# EAGLE design Gesamtschaltung (EAGLE 6.5.0)
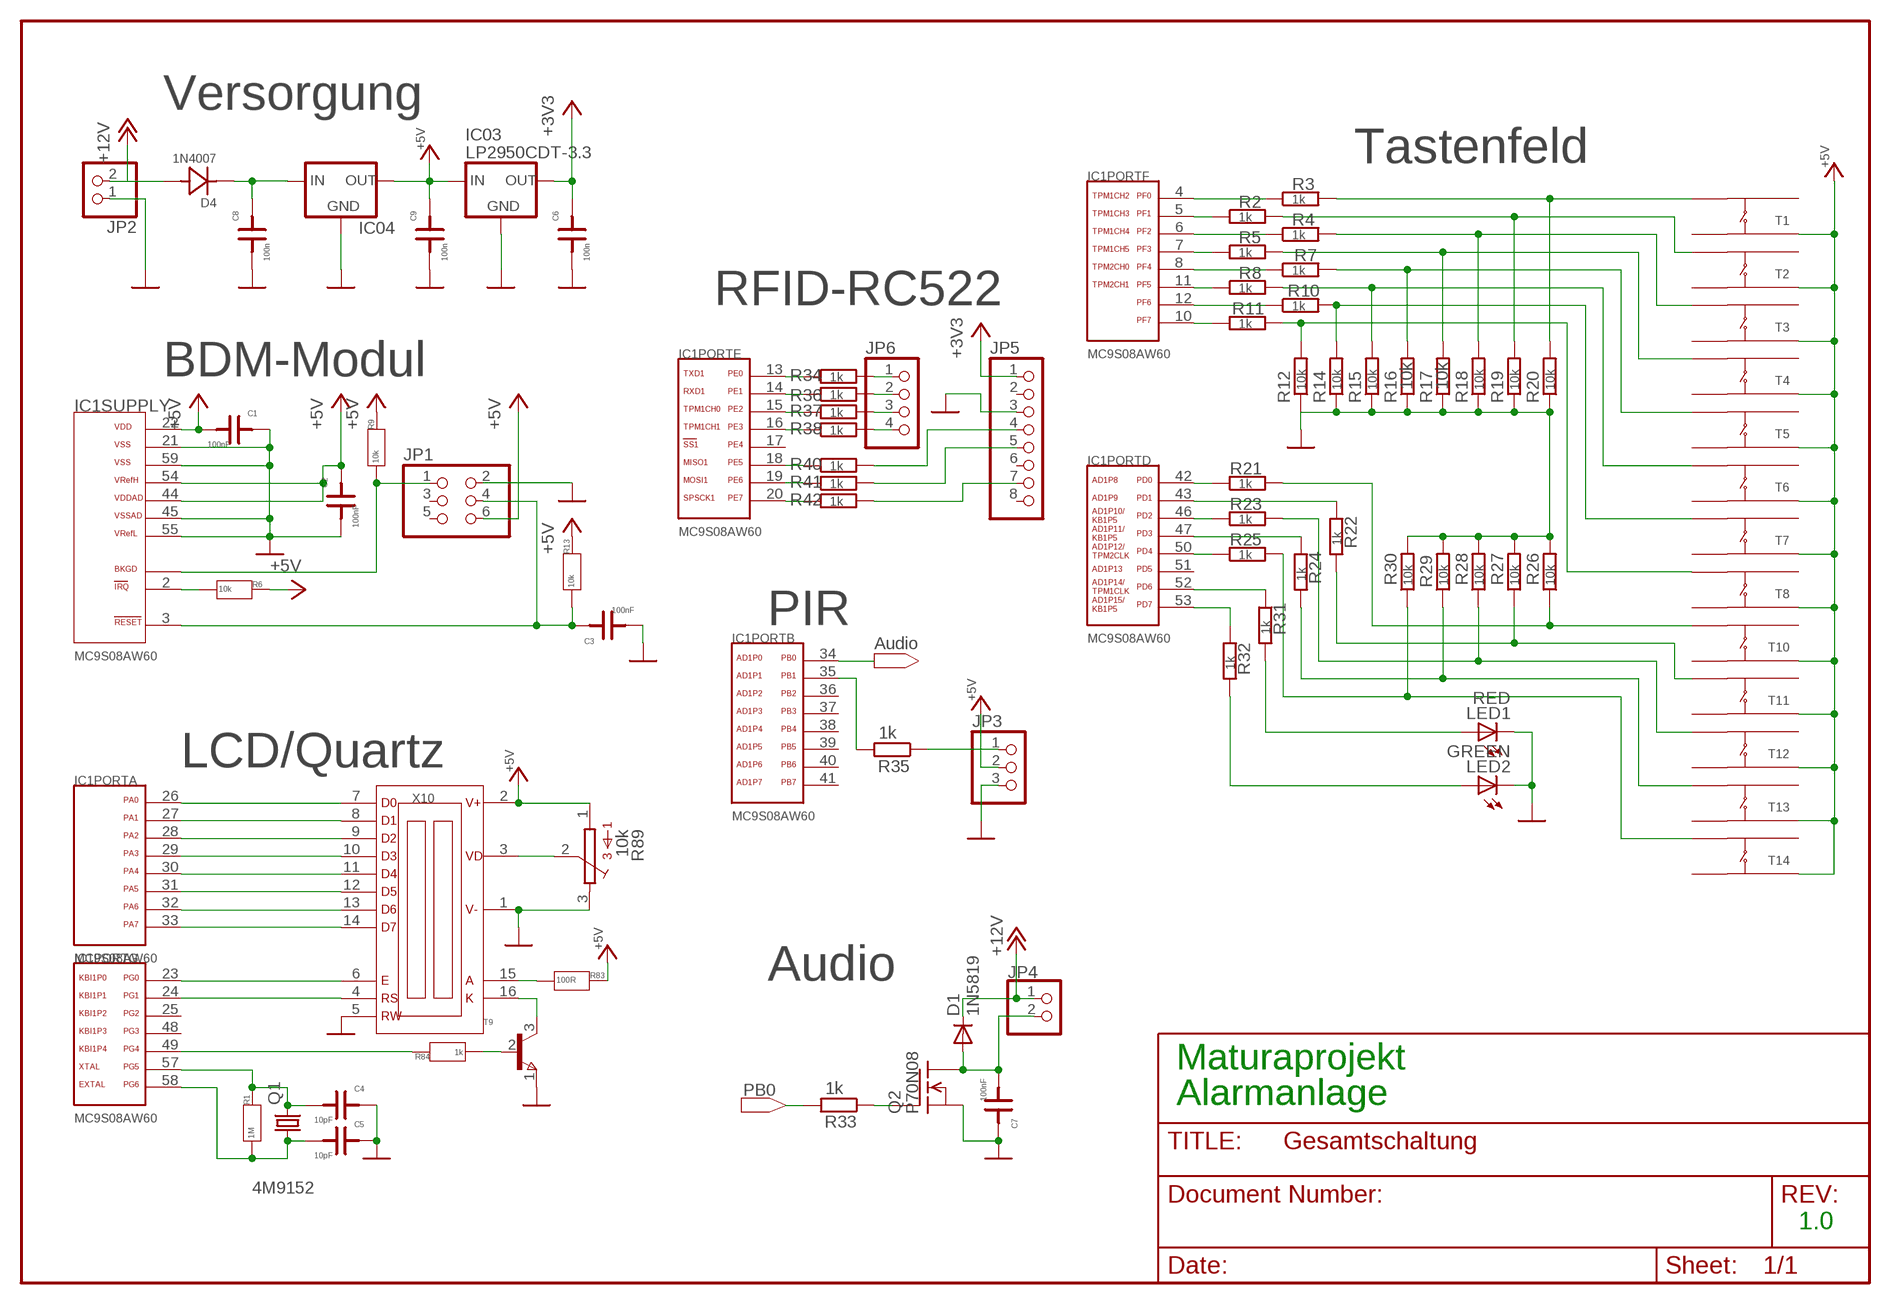
[diagram p0: schematic, sheet 1]

## Parts
C1  100nF  C1  [0805F]
C2  100nF  C1  [0805F]
C3  100nF  C1  [0805F]
C4  10pF  C1  [0805F]
C5  10pF  C1  [0805F]
C6  100n  C1  [0805F]
C7  100nF  C1  [0805F]
C8  100n  C1  [0805F]
C9  100n  C1  [0805F]
D1  1N5819  1N4004  [DO41-10]
D4  1N4007  DHC  [D400BH]
IC1  MC9S08AW60  [LQFP64]
IC03  LP2950CDT-3.3  [DPACK]
IC04  78XXS  [78XXS]
JP1  PINHD-2X3  [2X03]
JP2  PINHD-1X2  [1X02]
JP3  PINHD-1X3  [1X03]
JP4  PINHD-1X2  [1X02]
JP5  PINHD-1X8  [1X08]
JP6  PINHD-1X4  [1X04]
LED1  RED  LED3MM  [LED3MM]
LED2  GREEN  LED3MM  [LED3MM]
Q1  4M9152  HC49UP  [HC49UP]
Q2  P70N08  BUZ11  [TO220]
R1  1M  R1  [0805]
R2  1k  R-EU_M0805  [M0805]
R3  1k  R-EU_M0805  [M0805]
R4  1k  R-EU_M0805  [M0805]
R5  1k  R-EU_M0805  [M0805]
R6  10k  R1  [0805]
R7  1k  R-EU_M0805  [M0805]
R8  1k  R-EU_M0805  [M0805]
R9  10k  R1  [0805]
R10  1k  R-EU_M0805  [M0805]
R11  1k  R-EU_M0805  [M0805]
R12  10k  R-EU_M0805  [M0805]
R13  10k  R1  [0805]
R14  10k  R-EU_M0805  [M0805]
R15  10k  R-EU_M0805  [M0805]
R16  10k  R-EU_M0805  [M0805]
R17  10k  R-EU_M0805  [M0805]
R18  10k  R-EU_M0805  [M0805]
R19  10k  R-EU_M0805  [M0805]
R20  10k  R-EU_M0805  [M0805]
R21  1k  R-EU_M0805  [M0805]
R22  1k  R-EU_M0805  [M0805]
R23  1k  R-EU_M0805  [M0805]
R24  1k  R-EU_M0805  [M0805]
R25  1k  R-EU_M0805  [M0805]
R26  10k  R-EU_M0805  [M0805]
R27  10k  R-EU_M0805  [M0805]
R28  10k  R-EU_M0805  [M0805]
R29  10k  R-EU_M0805  [M0805]
R30  10k  R-EU_M0805  [M0805]
R31  1k  R-EU_R0805  [R0805]
R32  1k  R-EU_R0805  [R0805]
R33  1k  R-EU_0207/10  [0207/10]
R34  1k  R-EU_M0805  [M0805]
R35  1k  R-EU_M0805  [M0805]
R36  1k  R-EU_M0805  [M0805]
R37  1k  R-EU_M0805  [M0805]
R38  1k  R-EU_M0805  [M0805]
R40  1k  R-EU_M0805  [M0805]
R41  1k  R-EU_M0805  [M0805]
R42  1k  R-EU_M0805  [M0805]
R83  100R  R1  [0805]
R84  1k  R1  [0805]
R89  10k  S63X  [S63X]
T1  TASTERTHT  [TASTE_THT]
T2  TASTERTHT  [TASTE_THT]
T3  TASTERTHT  [TASTE_THT]
T4  TASTERTHT  [TASTE_THT]
T5  TASTERTHT  [TASTE_THT]
T6  TASTERTHT  [TASTE_THT]
T7  TASTERTHT  [TASTE_THT]
T8  TASTERTHT  [TASTE_THT]
T9  BC817  [SOT-23]
T10  TASTERTHT  [TASTE_THT]
T11  TASTERTHT  [TASTE_THT]
T12  TASTERTHT  [TASTE_THT]
T13  TASTERTHT  [TASTE_THT]
T14  TASTERTHT  [TASTE_THT]
X10  FDCC1602E  [FDCC1602E]

## Nets
+3V3: C6.2 IC03.3(OUT) JP5.1
+5V: C1.1 C2.2 C9.2 IC1.22(SUPPLY:VDD) IC1.44(SUPPLY:VDDAD) IC1.54(SUPPLY:VREFH) IC03.1(IN) IC04.OUT JP1.6 JP3.2 R6.2 R9.2 R13.2 R83.2 R89.1 T1.A1 T2.A1 T3.A1 T4.A1 T5.A1 T6.A1 T7.A1 T8.A1 T10.A1 T11.A1 T12.A1 T13.A1 T14.A1 X10.2(V+)
+12V: D1.C D4.A JP2.2 JP4.1
BKGD: IC1.56(SUPPLY:BKGD) JP1.1 R9.1
D0: IC1.26(PORTA:PA0) X10.7(D0)
D1: IC1.27(PORTA:PA1) X10.8(D1)
D2: IC1.28(PORTA:PA2) X10.9(D2)
D3: IC1.29(PORTA:PA3) X10.10(D3)
GND: C1.2 C2.1 C3.1 C4.2 C5.2 C6.1 C7.2 C8.1 C9.1 IC1.21(SUPPLY:VSS) IC1.45(SUPPLY:VSSAD) IC1.55(SUPPLY:VREFL) IC1.59(SUPPLY:VSS2) IC03.4(GND) IC04.GND JP1.2 JP2.1 JP3.3 JP5.3 LED1.K(C) LED2.K(C) Q2.3(S) R12.1 R14.1 R15.1 R16.1 R17.1 R18.1 R19.1 R20.1 R26.2 R27.2 R28.2 R29.2 R30.2 R89.3 T9.1(E) X10.1(V-) X10.5(RW)
IRQ: IC1.2(SUPPLY:IRQ/) R6.1
LCD_LED: IC1.49(PORTG:PG4) R84.2
N$1: C8.2 D4.K IC04.IN
N$2: R3.2 R20.2 T1.B2
N$3: R2.2 R19.2 T2.B2
N$4: IC1.42(PORTD:PD0) R21.1
N$5: R4.2 R18.2 T3.B2
N$6: R5.2 R17.2 T4.B2
N$7: R7.2 R16.2 T5.B2
N$8: IC1.46(PORTD:PD2) R23.1
N$9: IC1.50(PORTD:PD4) R25.1
N$10: R21.2 R26.1 T10.B2
N$11: R8.2 R15.2 T6.B2
N$12: R10.2 R14.2 T7.B2
N$13: R11.2 R12.2 T8.B2
N$14: IC1.5(PORTF:PF1) R2.1
N$15: IC1.6(PORTF:PF2) R4.1
N$16: C4.1 IC1.57(PORTG:PG5) Q1.2 R1.2
N$17: IC1.43(PORTD:PD1) R22.1
N$18: IC1.47(PORTD:PD3) R24.1
N$19: R22.2 R27.1 T11.B2
N$20: IC1.53(PORTD:PD7) R32.1
N$21: IC1.7(PORTF:PF3) R5.1
N$22: C5.1 IC1.58(PORTG:PG6) Q1.1 R1.1
N$23: IC1.8(PORTF:PF4) R7.1
N$24: IC1.11(PORTF:PF5) R8.1
N$25: IC1.12(PORTF:PF6) R10.1
N$26: IC1.10(PORTF:PF7) R11.1
N$27: IC1.4(PORTF:PF0) R3.1
N$28: R24.2 R29.1 T13.B2
N$29: IC1.52(PORTD:PD6) R31.1
N$30: R23.2 R28.1 T12.B2
N$31: R25.2 R30.1 T14.B2
N$32: IC1.13(PORTE:PE0) R34.1
N$33: LED2.A R32.2
N$34: LED1.A R31.2
N$35: JP5.7 R42.2
N$36: IC1.34(PORTB:PB0) R33.2
N$37: JP3.1 R35.1
N$38: JP5.5 R41.2
N$39: JP5.4 R40.2
N$40: Q2.1(G) R33.1
N$41: IC1.35(PORTB:PB1) R35.2
N$42: IC1.14(PORTE:PE1) R36.1
N$43: IC1.15(PORTE:PE2) R37.1
N$44: IC1.16(PORTE:PE3) R38.1
N$45: JP6.4 R38.2
N$46: C7.1 D1.A JP4.2 Q2.2(D)
N$47: IC1.18(PORTE:PE5) R40.1
N$48: IC1.19(PORTE:PE6) R41.1
N$49: IC1.30(PORTA:PA4) X10.11(D4)
N$50: IC1.31(PORTA:PA5) X10.12(D5)
N$51: IC1.32(PORTA:PA6) X10.13(D6)
N$52: IC1.33(PORTA:PA7) X10.14(D7)
N$53: IC1.20(PORTE:PE7) R42.1
N$54: JP6.3 R37.2
N$55: IC1.23(PORTG:PG0) X10.6(E)
N$56: JP6.2 R36.2
N$57: JP6.1 R34.2
N$58: IC1.24(PORTG:PG1) X10.4(RS)
N$60: R89.2 X10.3(VD)
N$86: R83.1 X10.15(A)
N$87: T9.3(C) X10.16(K)
N$88: R84.1 T9.2(B)
RESET: C3.2 IC1.3(SUPPLY:RST/) JP1.4 R13.1
Unconnected: IC1.1(PORTC:PC4) IC1.9(PORTC:PC6) IC1.17(PORTE:PE4) IC1.25(PORTG:PG2) IC1.36(PORTB:PB2) IC1.37(PORTB:PB3) IC1.38(PORTB:PB4) IC1.39(PORTB:PB5) IC1.40(PORTB:PB6) IC1.41(PORTB:PB7) IC1.48(PORTG:PG3) IC1.51(PORTD:PD5) IC1.60(PORTC:PC0) IC1.61(PORTC:PC1) IC1.62(PORTC:PC2) IC1.63(PORTC:PC3) IC1.64(PORTC:PC5) JP1.3 JP1.5 JP5.2 JP5.6 JP5.8 T1.A2 T1.B1 T2.A2 T2.B1 T3.A2 T3.B1 T4.A2 T4.B1 T5.A2 T5.B1 T6.A2 T6.B1 T7.A2 T7.B1 T8.A2 T8.B1 T10.A2 T10.B1 T11.A2 T11.B1 T12.A2 T12.B1 T13.A2 T13.B1 T14.A2 T14.B1

## Notes on the sheet
- Versorgung
- Tastenfeld
- RFID-RC522
- BDM-Modul
- PIR
- Audio
- LCD/Quartz
- Audio
- Maturaprojekt
- PB0
- Alarmanlage
- 1.0

## Library data of the parts
C1-C9 = deto:C
D1 = diode:1N4004: DIODE general purpose rectifier, 1 A
D4 = deto:DHC: Hii-Curr-Diode, Silizium, Typ Gleichrichter z.B. wie 1N4007 oder ähnlich
IC1 = MOTOROLA:MC9S08AW60
IC03 = v-reg:LP2950?*: Source: http://cache.national.com/ds/LP/LP2950.pdf
IC04 = v-reg:78XXS: VOLTAGE REGULATOR
JP1 = pinhead:PINHD-2X3
JP2 JP4 = pinhead:PINHD-1X2: PIN HEADER
JP3 = pinhead:PINHD-1X3: PIN HEADER
JP5 = pinhead:PINHD-1X8: PIN HEADER
JP6 = pinhead:PINHD-1X4: PIN HEADER
LED1 LED2 = led:LED: LED OSRAM: - CHIPLED LG R971, LG N971, LY N971, LG Q971, LY Q971, LO R971, LY R971 LH N974, LH R974 LS Q976, LO Q976, LY Q976 LO Q996 - Hyper CHIPLED LW Q18S LB Q993, LB Q99A, LB R99A - SideLED LS A670, LO A670, LY A670, LG A670, LP A670 LB A673, LV A673, LT A673, LW A673 LH A674 LY A675 LS A676, LA A676, LO A676, LY A676, LW A676 LS A679, LY A679, LG A679 - Hyper Micro SIDELED® LS Y876, LA Y876, LO Y876, LY Y876 LT Y87S - SmartLED LW L88C, LW L88S LB L89C, LB L89S, LG L890 LS L89K, LO L89K, LY L89K LS L896, LA L896, LO L896, LY L896 - TOPLED LS T670, LO T670, LY T670, LG T670, LP T670 LSG T670, LSP T670, LSY T670, LOP T670, LYG T670 LG T671, LOG T671, LSG T671 LB T673, LV T673, LT T673, LW T673 LH T674 LS T676, LA T676, LO T676, LY T676, LB T676, LH T676, LSB T676, LW T676 LB T67C, LV T67C, LT T67C, LS T67K, LO T67K, LY T67K, LW E67C LS E67B, LA E67B, LO E67B, LY E67B, LB E67C, LV E67C, LT E67C LW T67C LS T679, LY T679, LG T679 LS T770, LO T770, LY T770, LG T770, LP T770 LB T773, LV T773, LT T773, LW T773 LH T774 LS E675, LA E675, LY E675, LS T675 LS T776, LA T776, LO T776, LY T776, LB T776 LHGB T686 LT T68C, LB T68C - Hyper Mini TOPLED® LB M676 - Mini TOPLED Santana® LG M470 LS M47K, LO M47K, LY M47K Source: http://www.osram.convergy.de LUXEON: - LUMILED® LXK2-PW12-R00, LXK2-PW12-S00, LXK2-PW14-U00, LXK2-PW14-V00 LXK2-PM12-R00, LXK2-PM12-S00, LXK2-PM14-U00 LXK2-PE12-Q00, LXK2-PE12-R00, LXK2-PE12-S00, LXK2-PE14-T00, LXK2-PE14-U00 LXK2-PB12-K00, LXK2-PB12-L00, LXK2-PB12-M00, LXK2-PB14-N00, LXK2-PB14-P00, LXK2-PB14-Q00 LXK2-PR12-L00, LXK2-PR12-M00, LXK2-PR14-Q00, LXK2-PR14-R00 LXK2-PD12-Q00, LXK2-PD12-R00, LXK2-PD12-S00 LXK2-PH12-R00, LXK2-PH12-S00 LXK2-PL12-P00, LXK2-PL12-Q00, LXK2-PL12-R00 Source: www.luxeon.com KINGBRIGHT: KA-3528ASYC Source: www.kingbright.com
Q1 = crystal:HC49UP: CRYSTAL
Q2 = transistor-fet:BUZ11: N-Channel Enhancement MOSFET 50V; 30A; 0,040Ohm
R1 R6 R9 R13 R83 R84 = deto:R: Widerstand 400 mil - 0805 - 1206
R2-R5 R7 R8 R10-R12 R14-R38 R40-R42 = rcl:R-EU_: RESISTOR, European symbol
R89 = pot:S63X: POTENTIOMETER
T1-T8 T10-T14 = deto:TASTER: Taste SMD, Typ DIPTRONICS DTSM-644K Distrelec-Best.Nr: 200312
T9 = deto:BC817
X10 = DISP-LCD:FDCC1602: LCD 2x16 Zeichen FDCC1602_x_FLYYBWJ Fordatata, wobei das "x" durch das Variant ersetzt wird! www.fordata.com

## Board
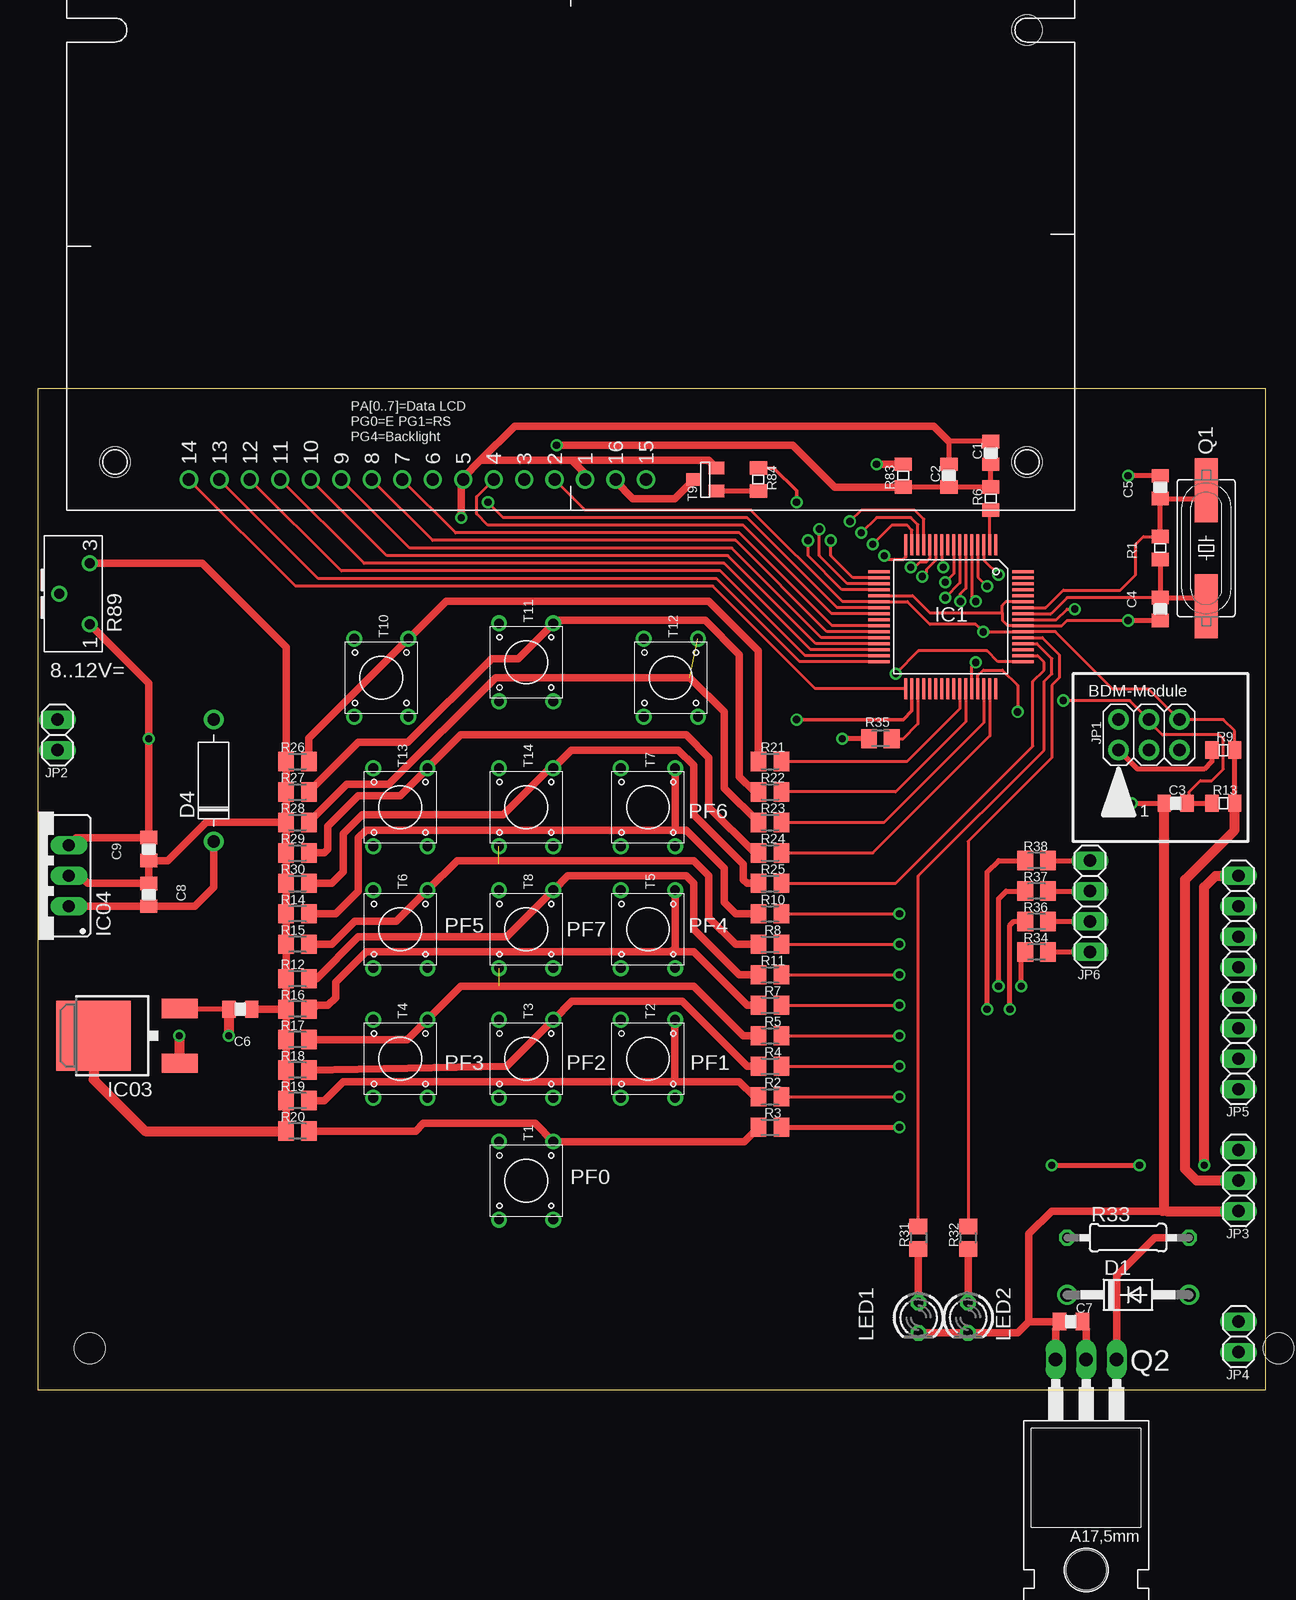
[diagram p1: board, top side]
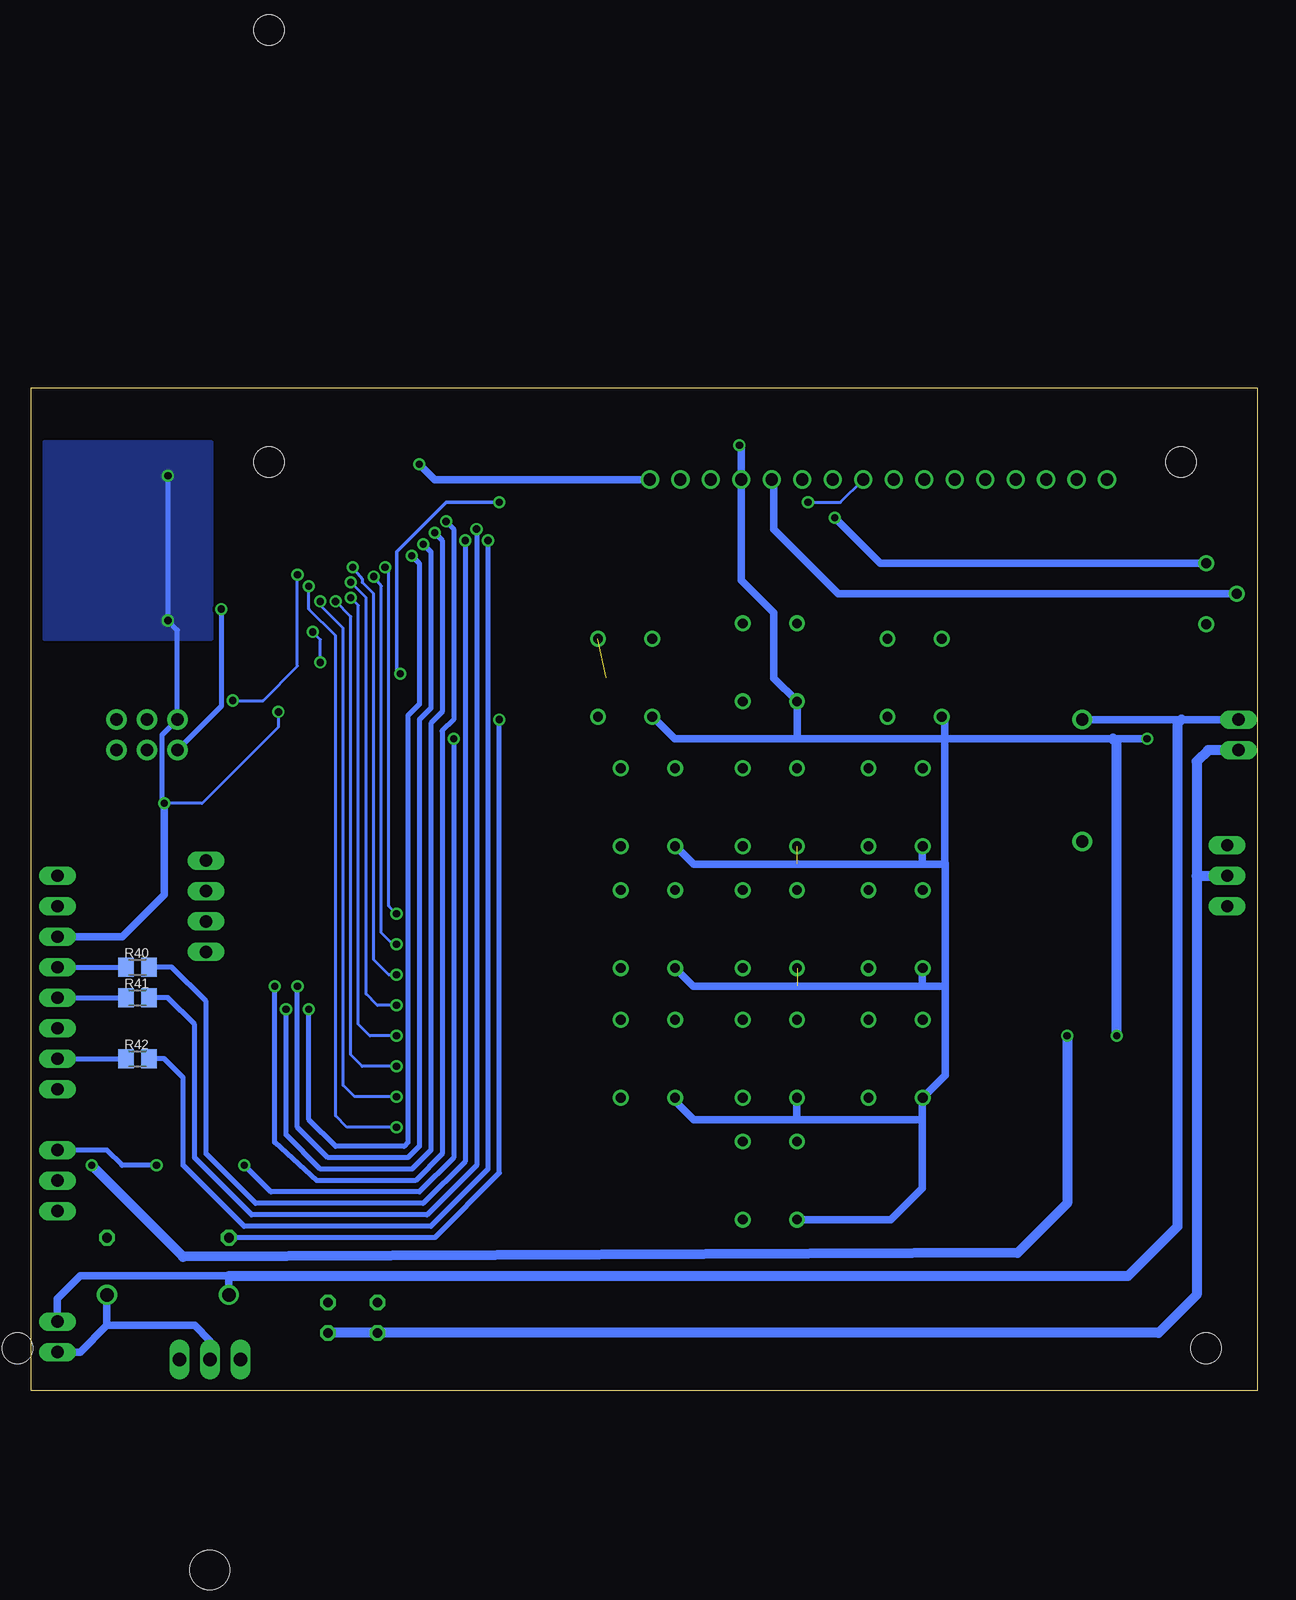
[diagram p2: board, bottom side, seen from below]

No outline drawn. Coordinates in mm, seen from the top.
Copper layers (1*16): Top 0.035mm / dielectric 1.5mm / Bottom 0.035mm
Design rules "default *": minimum track width 0.253746875mm, minimum drill 19mil, track to track 8mil, track to pad 8mil, pad to pad 8mil, via to via 8mil, smd to smd 8mil, copper to edge 40mil, drill to drill 8mil, minimum pad ring 10mil, minimum via ring 8mil, stop-mask expansion 0mil, vias tented up to drill 0mil, thermal gap 10mil
Holes 2.54 mm at 4.92,146.05 103.98,146.05 103.98,3.81 4.92,3.81
Milling: 5 lines

### Footprints (pad centres in the part's own frame; a part is rotated, then mirrored left to right if it is on the bottom)
0805F = smd 1.118 x 1.422: 1 -0.953,0; 2 0.953,0
DO41-10 = drill 1.118: A 5.08,0; C -5.08,0
D400BH = drill 1.016 pad 1.651: A 3.81,-1.27; K -6.35,-1.27
LQFP64 = smd 1.778 x 0.254: 1 -6,3.75; 2 -6,3.25; 3 -6,2.75; 4 -6,2.25; 5 -6,1.75; 6 -6,1.25; 7 -6,0.75; 8 -6,0.25; 9 -6,-0.25; 10 -6,-0.75; 11 -6,-1.25; 12 -6,-1.75; 13 -6,-2.25; 14 -6,-2.75; 15 -6,-3.25; 16 -6,-3.75; 33 6,-3.75; 34 6,-3.25; 35 6,-2.75; 36 6,-2.25; 37 6,-1.75; 38 6,-1.25; 39 6,-0.75; 40 6,-0.25; 41 6,0.25; 42 6,0.75; 43 6,1.25; 44 6,1.75; 45 6,2.25; 46 6,2.75; 47 6,3.25; 48 6,3.75 | smd 0.254 x 1.778: 17 -3.75,-6; 18 -3.25,-6; 19 -2.75,-6; 20 -2.25,-6; 21 -1.75,-6; 22 -1.25,-6; 23 -0.75,-6; 24 -0.25,-6; 25 0.25,-6; 26 0.75,-6; 27 1.25,-6; 28 1.75,-6; 29 2.25,-6; 30 2.75,-6; 31 3.25,-6; 32 3.75,-6; 49 3.75,6; 50 3.25,6; 51 2.75,6; 52 2.25,6; 53 1.75,6; 54 1.25,6; 55 0.75,6; 56 0.25,6; 57 -0.25,6; 58 -0.75,6; 59 -1.25,6; 60 -1.75,6; 61 -2.25,6; 62 -2.75,6; 63 -3.25,6; 64 -3.75,6
DPACK = smd 1.6 x 3: 1 -2.28,-4.8; 3 2.28,-4.8 | smd 5.8 x 6.2: 4 0,2.38
78XXS = drill 1.016 long: GND 0,-2.54; IN -2.54,-2.54; OUT 2.54,-2.54
2X03 = drill 1.016 pad 1.676: 1 -2.54,-1.27; 2 -2.54,1.27; 3 0,-1.27; 4 0,1.27; 5 2.54,-1.27; 6 2.54,1.27
1X02 = drill 1.016 long: 1 -1.27,0; 2 1.27,0
1X03 = drill 1.016 long: 1 -2.54,0; 2 0,0; 3 2.54,0
1X08 = drill 1.016 long: 1 -8.89,0; 2 -6.35,0; 3 -3.81,0; 4 -1.27,0; 5 1.27,0; 6 3.81,0; 7 6.35,0; 8 8.89,0
1X04 = drill 1.016 long: 1 -3.81,0; 2 -1.27,0; 3 1.27,0; 4 3.81,0
LED3MM = drill 0.813 octagon: A -1.27,0; K 1.27,0
HC49UP = smd 5.334 x 1.93: 1 -4.826,0; 2 4.826,0
TO220 = drill 1.118 long: 1 -2.54,-6.35; 2 0,-6.35; 3 2.54,-6.35 | hole 3.302: 0,11.176
0805 = smd 1.118 x 1.422: 1 -0.953,0; 2 0.953,0
M0805 = smd 1.3 x 1.6: 1 -0.95,0; 2 0.95,0
R0805 = smd 1.3 x 1.5: 1 -0.95,0; 2 0.95,0
0207/10 = drill 0.813 octagon: 1 -5.08,0; 2 5.08,0
S63X = drill 0.813: 1 2.54,0; 2 0,-2.54; 3 -2.54,0
TASTE_THT = drill 0.813: A1 -3.251,2.261; A2 3.251,2.261; B1 -3.251,-2.261; B2 3.251,-2.261
SOT-23 = smd 1.016 x 1.27: 1 -0.953,0.953; 2 0.953,0.953; 3 0,-0.953
FDCC1602E = drill 1.016: 1 43.18,2.54; 2 40.64,2.54; 3 38.1,2.54; 4 35.56,2.54; 5 33.02,2.54; 6 30.48,2.54; 7 27.94,2.54; 8 25.4,2.54; 9 22.86,2.54; 10 20.32,2.54; 11 17.78,2.54; 12 15.24,2.54; 13 12.7,2.54; 14 10.16,2.54; 15 48.26,2.54; 16 45.72,2.54 | hole 2.54: 4,4; 80,4; 80,40

### Placement (x,y rotation side)
C1  80.01,78.42 90 top
C2  76.52,76.52 270 top
C3  95.41,49.21 0 top
C4  94.14,65.41 270 top
C5  94.14,75.57 90 top
C6  17.46,32.07 180 top
C7  86.68,6.03 180 top
C8  9.84,41.59 270 top
C9  9.84,45.4 90 top
D1  91.44,8.26 0 top
D4  13.97,52.39 90 top
IC1  76.68,64.77 270 top
IC03  7.62,29.84 90 top
IC04  0.64,43.18 90 top
JP1  93.19,54.93 0 top
JP2  2.22,54.93 90 top
JP3  100.65,17.78 270 top
JP4  100.65,4.76 270 top
JP5  100.65,34.29 270 top
JP6  88.27,40.64 90 top
LED1  73.98,6.35 270 top
LED2  78.11,6.35 270 top
Q1  97.95,70.49 270 top
Q2  87.95,-3.49 180 top
R1  94.14,70.49 270 top
R2  61.59,24.77 180 top
R3  61.59,22.23 180 top
R4  61.59,27.3 180 top
R5  61.59,29.84 180 top
R6  80.01,74.61 90 top
R7  61.59,32.38 180 top
R8  61.59,37.47 180 top
R9  99.38,53.66 0 top
R10  61.59,40.01 180 top
R11  61.59,34.92 180 top
R12  22.23,34.61 0 top
R13  99.38,49.21 0 top
R14  22.23,40.01 0 top
R15  22.23,37.47 0 top
R16  22.23,32.07 0 top
R17  22.23,29.53 0 top
R18  22.23,26.99 0 top
R19  22.23,24.45 0 top
R20  22.23,21.91 0 top
R21  61.59,52.7 180 top
R22  61.59,50.16 180 top
R23  61.59,47.62 180 top
R24  61.59,45.09 180 top
R25  61.59,42.55 180 top
R26  22.23,52.7 180 top
R27  22.23,50.16 180 top
R28  22.23,47.62 180 top
R29  22.23,45.09 180 top
R30  22.23,42.55 180 top
R31  73.98,13.02 270 top
R32  78.11,13.02 270 top
R33  91.44,13.02 180 top
R34  83.82,36.83 0 top
R35  70.8,54.61 0 top
R36  83.82,39.37 0 top
R37  83.82,41.91 0 top
R38  83.82,44.45 0 top
R40  93.98,35.56 180 bottom
R41  93.98,33.02 180 bottom
R42  93.98,27.94 180 bottom
R83  72.71,76.52 270 top
R84  60.64,76.2 90 top
R89  4.92,66.67 270 top
T1  41.27,17.78 90 top
T2  51.44,27.94 90 top
T3  41.27,27.94 90 top
T4  30.8,27.94 90 top
T5  51.44,38.73 90 top
T6  30.8,38.73 90 top
T7  51.44,48.9 90 top
T8  41.27,38.73 90 top
T9  56.2,76.2 270 top
T10  29.21,59.69 90 top
T11  41.27,60.96 90 top
T12  53.34,59.69 90 top
T13  30.8,48.9 90 top
T14  41.27,48.9 90 top
X10  3.02,73.66 0 top

### Tracks (layer width: path | path; a pad name or v marks a point on that pad's centre or on a via)
+3V3  (via drill 0.6)
  Top 0.406: C6.2 12.48,32.07 IC03.3
  Top 0.813: C6.2 v16.51,29.84 | v97.79,19.05 97.79,42.23 98.74,43.18 JP5.1
  Bottom 0.813: v16.51,29.84 16.51,15.88 20.64,11.75 90.17,11.43 v97.79,19.05
+5V  (via drill 0.6)  (2 unrouted)
  Top 0.254: R9.2 100.33,55.24 99.38,56.2 JP1.6 93.19,58.74 90.17,58.74 85.39,63.52 IC1.54 82.66,63.5 v79.38,63.5 78.74,64.14 74.93,64.14 73.05,66.02 IC1.22 67.65,66.02 60.01,73.66 46.2,73.66 X10.2 | IC1.44 78.43,60.64 78.42,60.64 v78.74,60.96
  Top 0.406: R13.2 R9.2 | C1.1 R6.2 C2.2 R83.2
  Top 0.61: IC04.OUT 3.81,46.35 C9.2 v9.84,54.61 9.84,59.21 R89.1 | v43.81,79.06 63.5,79.06 66.99,75.56 R83.2
  Top 0.813: IC03.1 12.42,29.81 v12.38,29.84 | JP3.2 97.16,17.78 96.2,18.73 96.2,42.86 100.33,46.99 R13.2
  Bottom 0.254: v78.74,60.96 78.74,62.87 v79.38,63.5
  Bottom 0.61: v9.84,54.61 12.7,54.61 26.71,54.61 | 26.71,54.61 26.71,56.24 26.99,56.52 T10.A1 26.67,56.2 | T13.A1 28.57,45.4 28.57,44.13 | 26.67,44.13 26.71,44.49 26.71,54.61 | 28.57,44.13 26.67,44.13 | 26.67,44.13 26.67,33.97 | 28.57,33.97 39.05,33.97 | 39.05,33.97 47.66,33.97 T5.A1 | T7.A1 49.14,45.64 47.62,44.13 39.05,44.13 | 39.05,44.13 28.57,44.13 | 26.67,33.97 28.57,33.97 | 28.57,33.97 28.57,35.45 T6.A1 | 39.01,34.01 39.05,33.97 | 39.01,44.17 39.05,44.13 | T12.A1 51.04,56.44 49.21,54.61 39.05,54.61 | 39.05,54.61 26.71,54.61 | 39.05,54.61 39.01,55.21 T11.A1 40.96,59.65 40.96,65.09 43.66,67.79 X10.2 43.66,78.9 v43.81,79.06 | 26.67,33.97 26.67,26.56 T4.A1 28.57,24.65 28.57,22.86 | T1.A1 31.19,14.53 28.57,17.14 28.57,22.86 | T2.A1 49.17,24.41 47.62,22.86 39.05,22.86 | 39.05,22.86 28.57,22.86 | T3.A1 39.01,24.73 39.05,24.77 39.05,22.86
  Bottom 0.813: v12.38,29.84 12.38,54.29 12.7,54.61
+12V
  Bottom 0.61: JP2.2 6.99,56.2 D4.A | D1.C 86.36,9.84 98.74,9.84 100.65,7.94 JP4.1
  Bottom 0.813: 86.36,9.84 11.43,9.84 7.3,13.97 7.3,55.88 6.99,56.2
BKGD  (via drill 0.6)
  Top 0.254: IC1.56 85.47,64.52 86.36,65.41 v87,65.41
  Top 0.406: R9.1 98.42,52.7 97.79,52.07 92.23,52.07 JP1.1
  Bottom 0.406: v87,65.41 87,57.31 JP1.1
D0
  Top 0.254: IC1.26 66.79,64.02 59.05,71.75 35.4,71.75 X10.7
D1
  Top 0.254: IC1.27 66.34,63.52 58.74,71.12 33.5,71.12 X10.8
D2
  Top 0.254: IC1.28 65.89,63.02 58.42,70.48 31.59,70.48 X10.9
D3
  Top 0.254: IC1.29 65.43,62.52 58.1,69.85 29.69,69.85 X10.10
GND  (via drill 0.6)
  Top 0.254: IC1.59 81.26,66.02 80.96,65.72 80.96,65.09 | 80.96,65.09 80.96,64.45 81.39,64.02 IC1.55 85.93,64.02 86.36,64.45 v91.44,64.45 | IC1.45 78.93,59.88 79.38,60.33 80.96,60.33 82.23,59.05 v82.23,56.83 | IC1.21 73.5,66.52 74.93,65.09 80.96,65.09
  Top 0.406: v91.76,49.21 C3.1 | C1.2 76.52,79.38 C2.1 | C5.2 v91.44,76.52 | v91.44,64.45 C4.2 | C4.2
  Top 0.61: Q2.3 85.41,5.4 85.72,5.71 C7.2 83.19,6.03 | LED1.K 82.23,5.08 83.19,6.03 | 83.19,6.03 83.19,13.34 85.09,15.24 94.3,15.24 | IC04.GND 4.13,43.18 4.76,42.55 C8.1 C9.1 11.43,44.45 14.61,47.62 R28.2 | R28.2 R27.2 R26.2 21.27,62.23 14.29,69.22 R89.3 | R28.2 R29.2 R12.1 21.27,42.23 R14.1 R15.1 R30.2 R16.1 | R16.1 R17.1 R18.1 R19.1 R20.1 | C6.1 R16.1 | v35.88,73.03 35.88,76.04 X10.5 36.04,76.36 37.47,77.79 | 37.47,77.79 40.32,80.64 75.25,80.64 76.52,79.38 | X10.1 46.2,76.68 45.09,77.79 | 45.09,77.79 37.47,77.79 | 45.09,77.79 56.52,77.79 T9.1
  Top 0.813: IC03.4 5.24,26.19 9.53,21.91 R20.1 | 94.3,15.24 94.46,15.4 | 94.46,15.4 C3.1 | 94.46,15.4 94.61,15.24 JP3.3
  Bottom 0.254: v82.23,56.83 82.23,55.56 88.58,49.21 v91.76,49.21
  Bottom 0.406: v91.44,76.52 v91.44,64.45 90.65,63.66 JP1.2 91.92,54.93 91.92,49.37 v91.76,49.21
  Bottom 0.61: JP5.3 95.25,38.1 91.76,41.59 v91.76,49.21 | LED1.K LED2.K | R89.3 32.07,69.22 v35.88,73.03
  Bottom 0.813: JP2.1 4.76,53.66 5.71,52.7 5.71,43.18 | 5.71,43.18 5.71,8.26 8.89,5.08 LED2.K | 5.71,43.18 IC04.GND
  pour Bottom: 87.79,79.38 87.79,62.86 101.76,62.87 101.76,79.38
IRQ
  Top 0.254: IC1.2 79.93,73.58 R6.1
LCD_LED  (via drill 0.6)
  Top 0.254: IC1.49 80.58,61.02 79.69,61.91 73.98,61.91 v72.07,60.01
  Top 0.305: v63.82,74.3 63.82,75.25 61.91,77.15 R84.2
  Bottom 0.254: v72.07,60.01 72.39,60.33
  Bottom 0.305: 72.39,60.33 72.39,70.17 68.26,74.3 v63.82,74.3
N$1
  Top 0.61: D4.K 15.24,42.23 13.65,40.64 C8.2 IC04.IN
N$2
  Top 0.61: R3.2 59.45,21.03 T1.B2 42.02,22.54 32.7,22.54 32.07,21.91 R20.2
N$3
  Top 0.61: R2.2 60.33,24.77 59.05,26.04 53.66,26.04 | T2.B2 53.66,31.15 53.66,26.04 | 53.66,26.04 26.04,26.04 24.45,24.45 R19.2
N$4
  Top 0.254: R21.1 73.03,52.7 77.43,57.11 IC1.42
N$5
  Top 0.61: R18.2 39.65,27.3 T3.B2 43.57,31.19 45.09,32.7 54.29,32.7 59.69,27.3 R4.2
N$6
  Top 0.61: R5.2 59.37,29.84 55.24,33.97 35.84,33.97 T4.B2 31.39,29.53 R17.2
N$7
  Top 0.61: R7.2 59.69,32.38 55.24,36.83 53.34,36.83 | 53.34,36.83 27.94,36.83 25.4,34.29 25.4,33.02 24.77,32.38 23.81,32.38 23.5,32.07 23.18,32.38 R16.2 | T5.B2 53.7,37.19 53.34,36.83
N$8
  Top 0.254: R23.1 71.12,47.62 79.43,55.93 IC1.46
N$9
  Top 0.254: R25.1 72.07,42.55 83.5,53.98 83.5,59.37 84.45,60.33 84.45,60.96 83.89,61.52 IC1.50
N$10
  Top 0.61: R26.1 23.18,54.65 T10.B2 31.51,62.94 34.61,66.04 56.52,66.04 60.64,61.91 R21.2
N$11
  Top 0.61: R8.2 58.74,37.47 56.52,39.69 56.52,43.18 55.24,44.45 35.52,44.45 T6.B2 30.44,39.37 26.99,39.37 25.08,37.47 R15.2
N$12
  Top 0.61: R10.2 58.74,40.01 57.78,40.96 57.78,43.81 54.61,46.99 53.66,46.99 | 53.66,46.99 27.94,46.99 27.3,46.35 27.3,41.91 25.4,40.01 R14.2 | T7.B2 53.7,47.35 53.66,46.99
N$13
  Top 0.61: R12.2 23.81,34.61 27.3,38.1 39.65,38.1 T8.B2 43.57,41.99 44.77,43.18 54.61,43.18 55.24,42.55 55.24,38.73 59.05,34.92 R11.2
N$14  (via drill 0.6)
  Top 0.254: R2.1 v72.39,24.77 | IC1.5 78.43,66.35 v78.74,66.04
  Bottom 0.254: v72.39,24.77 75.88,24.77 76.83,25.72 76.83,63.82 78.74,65.72 v78.74,66.04
N$15  (via drill 0.6)
  Top 0.254: R4.1 v72.39,27.3 | v77.47,66.04 77.47,66.67 77.93,67.13 IC1.6
  Bottom 0.254: v72.39,27.3 75.25,27.3 76.2,28.26 76.2,64.77 v77.47,66.04
N$16
  Top 0.254: C4.1 86.36,66.36 85.02,65.02 IC1.57
  Top 0.406: R1.2 C4.1 97.25,66.36 Q1.2
N$17
  Top 0.254: IC1.43 77.93,56.02 72.07,50.16 R22.1
N$18
  Top 0.254: R24.1 70.17,45.09 79.93,54.84 IC1.47
N$19
  Top 0.61: R22.2 60.33,50.16 59.05,51.44 59.05,61.59 56.2,64.45 43.78,64.45 T11.B2 43.54,64.17 40.64,61.28 38.42,61.28 31.43,54.29 27.3,54.29 R27.1
N$20
  Top 0.254: IC1.53 84.3,63.02 85.72,61.59 85.72,59.69 85.09,59.05 85.09,53.02 78.11,46.04 R32.1
N$21  (via drill 0.6)
  Top 0.254: R5.1 v72.39,29.84 | IC1.7 77.43,67.58 v76.2,66.36
  Bottom 0.254: v72.39,29.84 74.61,29.84 75.56,30.8 75.56,65.72 v76.2,66.36
N$22
  Top 0.254: IC1.58 84.57,65.52 86.04,66.99 90.81,66.99 92.08,68.26 92.08,70.8 92.71,71.44 R1.1 | R1.1
  Top 0.406: R1.1 C5.1 97.25,74.61 Q1.1
N$23  (via drill 0.6)
  Top 0.254: R7.1 v72.39,32.38 | IC1.8 76.93,68.35 v76.2,67.63
  Bottom 0.254: v72.39,32.38 73.98,32.38 74.93,33.34 74.93,66.36 v76.2,67.63
N$24  (via drill 0.6)
  Top 0.254: R8.1 v72.39,37.47 | IC1.11 75.43,69.48 74.62,68.68 74.62,68.44 v74.3,68.11
  Bottom 0.254: v72.39,37.47 72.71,37.47 73.66,38.42 73.66,67.31 v74.3,68.11
N$25  (via drill 0.6)
  Top 0.254: R10.1 v72.39,40.01 | v73.34,68.9 73.69,68.9 74.13,69.34 74.62,69.34 74.93,69.64 IC1.12
  Bottom 0.254: v72.39,40.01 73.03,40.64 73.03,68.58 v73.34,68.9
N$26  (via drill 0.6)
  Top 0.254: R11.1 v72.39,34.92 | IC1.10 75.93,69.58 v76.03,68.9
  Bottom 0.254: v72.39,34.92 73.03,34.92 74.3,36.2 74.3,66.67 75.25,67.63 75.25,67.94 v76.03,68.9
N$27  (via drill 0.6)
  Top 0.254: IC1.4 78.93,68.08 v79.69,67.31
  Top 0.406: R3.1 v72.39,22.23
  Bottom 0.254: v72.39,22.23 76.52,22.23 77.47,23.18 77.47,63.18 79.69,65.41 v79.69,67.31
N$28
  Top 0.61: R24.2 60.33,45.09 56.52,48.9 56.52,53.02 54.61,54.93 35.84,54.93 T13.B2 33.06,52.11 30.8,49.85 27.3,49.85 24.77,47.31 24.77,45.41 24.45,45.09 R29.1
N$29
  Top 0.254: R31.1 73.98,43.18 84.45,53.66 84.45,59.37 85.09,60.01 85.09,61.28 83.85,62.52 IC1.52
N$30  (1 unrouted)
  Top 0.61: R28.1 26.35,50.8 29.84,50.8 38.73,59.69 54.93,59.69 57.78,56.83 57.78,50.48 R23.2
N$31
  Top 0.61: R25.2 59.69,42.55 59.37,42.86 59.37,44.13 55.24,48.26 55.24,52.39 53.98,53.66 45.05,53.66 T14.B2 43.26,52.15 39.37,48.26 27.62,48.26 26.04,46.67 26.04,43.5 25.08,42.55 R30.1
N$32  (via drill 0.6)
  Top 0.254: IC1.13 74.43,72.89 73.66,73.66 69.22,73.66 v68.26,72.71
  Top 0.406: v82.55,33.97 82.55,36.51 R34.1
  Bottom 0.406: v68.26,72.71 67.63,72.07 67.63,56.2 68.58,55.24 68.58,20 70.8,17.78 79.06,17.78 82.55,20.95 v82.55,33.97
N$33
  Top 0.61: R32.2 LED2.A
N$34
  Top 0.61: R31.2 LED1.A
N$35
  Bottom 0.406: JP5.7 R42.2
N$36  (via drill 0.6)
  Top 0.305: v63.82,56.2 72.71,56.2 73.43,56.92 IC1.34
  Bottom 0.406: v63.82,56.2 63.82,18.41 69.22,13.02 R33.2
N$37  (via drill 0.6)
  Top 0.406: R35.1 v67.63,54.61 | v85.09,19.05 v92.39,19.05
  Bottom 0.406: v67.63,54.61 67.63,19.68 70.48,16.83 82.87,16.83 v85.09,19.05 | v92.39,19.05 95.25,19.05 96.52,20.32 JP3.1
N$38
  Bottom 0.406: JP5.5 R41.2
N$39
  Bottom 0.406: JP5.4 R40.2
N$40
  Top 0.61: R33.1 93.66,13.02 90.49,9.84 Q2.1
N$41
  Top 0.254: R35.2 72.71,54.61 73.93,55.83 IC1.35
N$42  (via drill 0.6)
  Top 0.254: v69.22,71.75 70.48,73.03 73.34,73.03 73.93,72.44 IC1.14
  Top 0.406: v81.6,32.07 81.6,39.05 81.92,39.37 R36.1
  Bottom 0.406: v69.22,71.75 68.58,71.12 68.58,56.83 69.53,55.88 69.53,20.32 71.12,18.73 78.74,18.73 81.6,21.59 v81.6,32.07
N$43  (via drill 0.6)
  Top 0.254: IC1.15 73.43,71.99 73.03,72.39 71.75,72.39 v70.17,70.8
  Top 0.406: v80.64,33.97 80.64,41.27 81.28,41.91 R37.1
  Bottom 0.406: v70.17,70.8 69.53,70.17 69.53,57.15 70.48,56.2 70.48,20.64 71.44,19.68 78.11,19.68 80.64,22.23 v80.64,33.97
N$44  (via drill 0.6)
  Top 0.254: IC1.16 72.93,69.75 72.71,69.53 71.44,69.53 v71.12,69.85
  Top 0.406: v79.69,32.07 79.69,43.5 80.64,44.45 R38.1
  Bottom 0.406: v79.69,32.07 79.69,22.86 77.47,20.64 71.75,20.64 71.44,20.95 71.44,56.52 70.48,57.47 70.48,69.22 v71.12,69.85
N$45
  Top 0.406: R38.2 JP6.4
N$46
  Top 0.61: C7.1 87.63,5.71 87.95,5.4 Q2.2
  Bottom 0.61: D1.A 96.52,5.71 | 96.52,5.71 98.74,3.49 JP4.2 | 96.52,5.71 89.22,5.71 87.95,4.45 Q2.2
N$47  (via drill 0.6)
  Top 0.254: IC1.18 68.5,68.02 66.67,69.85 v66.67,71.12
  Bottom 0.406: v66.67,71.12 66.67,19.37 70.17,15.88 84.14,15.88 88.27,20 88.27,32.7 91.12,35.56 R40.1
N$48  (via drill 0.6)
  Top 0.254: IC1.19 68.05,67.52 65.72,69.85 v65.72,72.07
  Bottom 0.406: v65.72,72.07 65.72,19.05 69.85,14.92 84.45,14.92 89.22,19.68 89.22,30.8 91.44,33.02 R41.1
N$49
  Top 0.254: IC1.30 64.98,62.02 57.78,69.22 27.78,69.22 X10.11
N$50
  Top 0.254: IC1.31 64.53,61.52 57.47,68.58 25.88,68.58 X10.12
N$51
  Top 0.254: IC1.32 64.08,61.02 57.15,67.94 23.97,67.94 X10.13
N$52
  Top 0.254: IC1.33 65.37,58.77 56.83,67.31 22.07,67.31 X10.14
N$53  (via drill 0.6)
  Top 0.254: IC1.20 67.6,67.02 64.77,69.85 v64.77,71.12
  Bottom 0.406: v64.77,71.12 64.77,18.73 69.53,13.97 85.09,13.97 90.17,19.05 90.17,26.35 91.76,27.94 R42.1
N$54
  Top 0.406: R37.2 JP6.3
N$55  (via drill 0.6)
  Top 0.254: IC1.23 67.19,65.52 59.69,73.03 39.37,73.03 v38.1,74.3
  Bottom 0.254: v38.1,74.3 35.4,74.3 X10.6
N$56
  Top 0.406: R36.2 JP6.2
N$57
  Top 0.406: R34.2 JP6.1
N$58
  Top 0.254: IC1.24 66.74,65.02 59.37,72.39 38.1,72.39 37.15,73.34 37.15,74.77 X10.4
N$60
  Bottom 0.61: R89.2 35.56,66.67 40.96,72.07 40.96,76.04 X10.3
N$86  (via drill 0.6)
  Top 0.61: v70.48,77.47 R83.1
  Bottom 0.61: X10.15 69.22,76.2 v70.48,77.47
N$87
  Top 0.61: X10.16 48.74,76.04 50.16,74.61 53.66,74.61 T9.3
N$88
  Top 0.406: T9.2 R84.1
RESET  (via drill 0.6)
  Top 0.254: 96.52,49.53 96.52,50.16 97.47,51.12 98.42,51.12 99.38,52.07 99.38,54.61 99.06,54.93 94.3,54.93 93.19,56.04 JP1.4 91.6,57.78 v86.04,57.78 | IC1.3 79.43,69.48 v80.64,68.26
  Top 0.305: C3.2 96.52,49.53
  Top 0.406: C3.2 R13.1
  Bottom 0.254: v86.04,57.78 83.5,57.78 80.64,60.64 v80.64,68.26

### Text on the board
tPlace: PA[0..7]=Data LCD | PG0=E PG1=RS | PG4=Backlight | 8..12V= | BDM-Module | PF6 | 1 | PF5 | PF7 | PF4 | PF3 | PF2 | PF1 | PF0